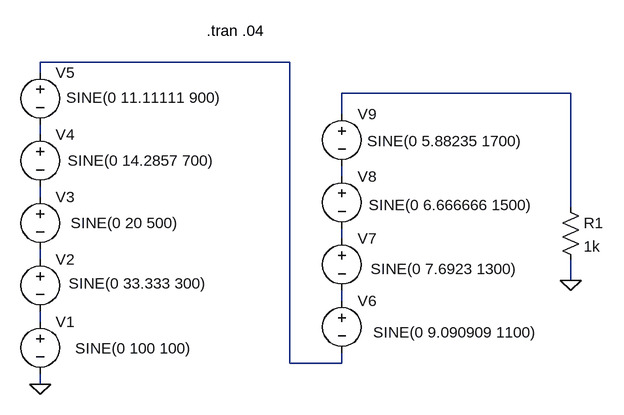
[diagram p0: schematic Fourier.asc]
Fourier.asc, the LTspice schematic file:
Version 4
SHEET 1 880 680
WIRE 144 -48 -240 -48
WIRE -240 -32 -240 -48
WIRE 576 0 224 0
WIRE 224 32 224 0
WIRE -240 64 -240 48
WIRE 224 128 224 112
WIRE -240 160 -240 144
WIRE 576 176 576 0
WIRE 224 224 224 208
WIRE -240 256 -240 240
WIRE 576 288 576 256
WIRE 224 320 224 304
WIRE -240 352 -240 336
WIRE 144 416 144 -48
WIRE 224 416 224 400
WIRE 224 416 144 416
WIRE -240 448 -240 432
FLAG -240 448 0
FLAG 576 288 0
SYMBOL voltage -240 336 R0
WINDOW 3 54 57 Left 0
WINDOW 123 0 0 Left 0
WINDOW 39 0 0 Left 0
SYMATTR Value SINE(0 100 100)
SYMATTR InstName V1
SYMBOL voltage -240 240 R0
WINDOW 3 44 53 Left 0
WINDOW 123 0 0 Left 0
WINDOW 39 0 0 Left 0
SYMATTR Value SINE(0 33.333 300)
SYMATTR InstName V2
SYMBOL voltage -240 144 R0
WINDOW 3 47 56 Left 0
WINDOW 123 0 0 Left 0
WINDOW 39 0 0 Left 0
SYMATTR Value SINE(0 20 500)
SYMATTR InstName V3
SYMBOL voltage -240 48 R0
WINDOW 3 42 56 Left 0
WINDOW 123 0 0 Left 0
WINDOW 39 0 0 Left 0
SYMATTR Value SINE(0 14.2857 700)
SYMATTR InstName V4
SYMBOL voltage -240 -48 R0
WINDOW 3 40 55 Left 0
WINDOW 123 0 0 Left 0
WINDOW 39 0 0 Left 0
SYMATTR Value SINE(0 11.11111 900)
SYMATTR InstName V5
SYMBOL voltage 224 304 R0
WINDOW 3 48 64 Left 0
WINDOW 123 0 0 Left 0
WINDOW 39 0 0 Left 0
SYMATTR Value SINE(0 9.090909 1100)
SYMATTR InstName V6
SYMBOL voltage 224 208 R0
WINDOW 3 44 63 Left 0
WINDOW 123 0 0 Left 0
WINDOW 39 0 0 Left 0
SYMATTR Value SINE(0 7.6923 1300)
SYMATTR InstName V7
SYMBOL voltage 224 112 R0
WINDOW 3 41 60 Left 0
WINDOW 123 0 0 Left 0
WINDOW 39 0 0 Left 0
SYMATTR Value SINE(0 6.666666 1500)
SYMATTR InstName V8
SYMBOL voltage 224 16 R0
WINDOW 3 39 58 Left 0
WINDOW 123 0 0 Left 0
WINDOW 39 0 0 Left 0
SYMATTR Value SINE(0 5.88235 1700)
SYMATTR InstName V9
SYMBOL res 560 160 R0
SYMATTR InstName R1
SYMATTR Value 1k
TEXT 16 -96 Left 0 !.tran .04

The netlist it stands for:
* Fourier.asc
V1 N009 0 SINE(0 100 100)
V2 N007 N009 SINE(0 33.333 300)
V3 N005 N007 SINE(0 20 500)
V4 N003 N005 SINE(0 14.2857 700)
V5 N001 N003 SINE(0 11.11111 900)
V6 N008 N001 SINE(0 9.090909 1100)
V7 N006 N008 SINE(0 7.6923 1300)
V8 N004 N006 SINE(0 6.666666 1500)
V9 N002 N004 SINE(0 5.88235 1700)
R1 N002 0 1k
.tran .04
.backanno
.end